# EAGLE schematic PowerConversionBoard (EAGLE 9.6.2)

## Sheet 1 of 2
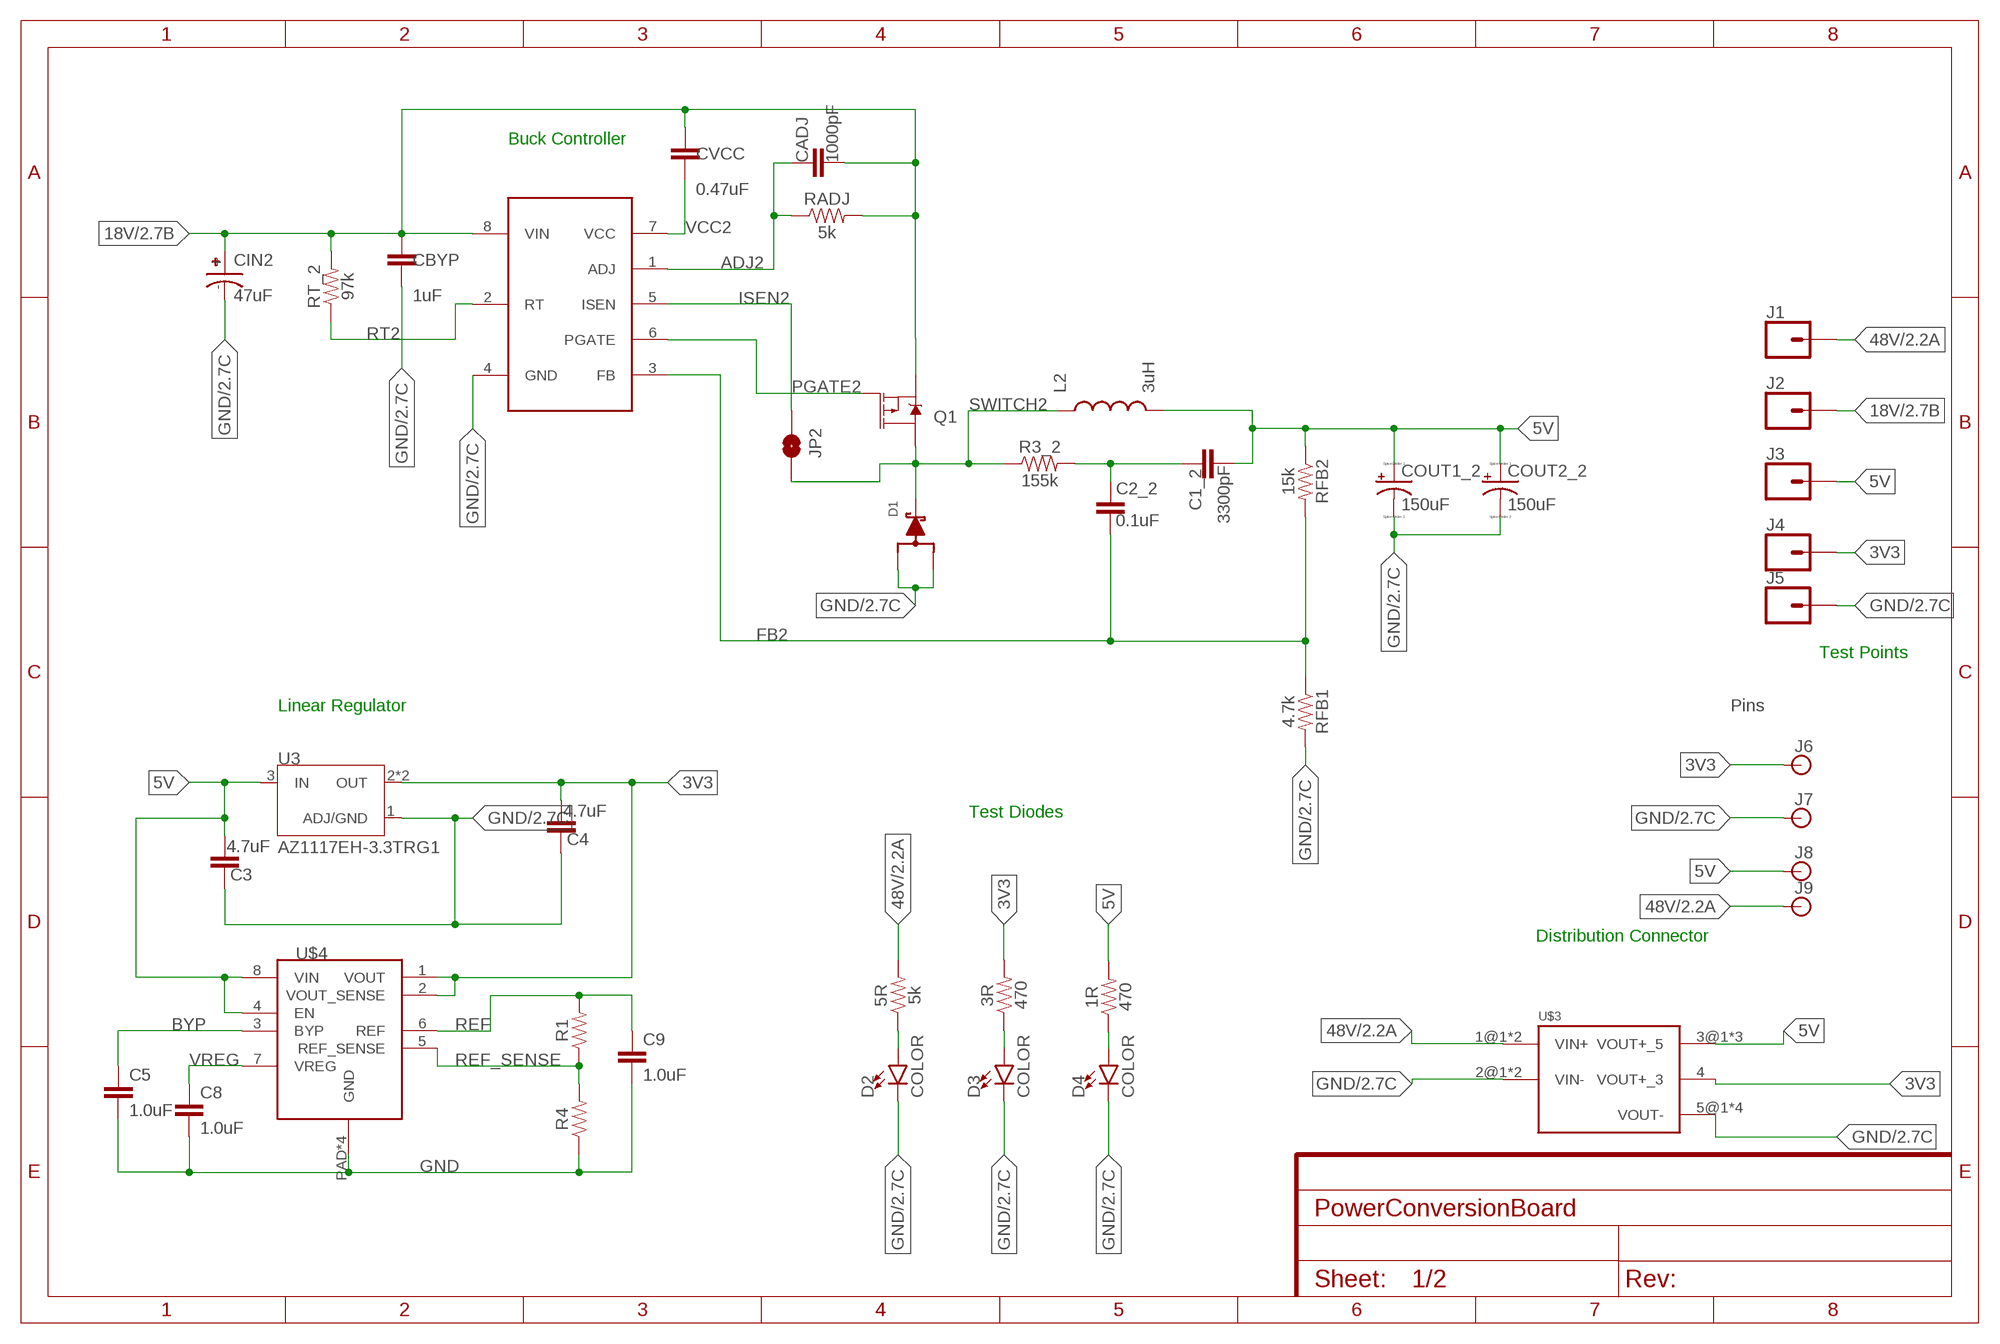
[diagram p0: schematic, sheet 1]

### Parts
1R  470  470OHM-0603-1/10W-1%  [0603]
3R  470  470OHM-0603-1/10W-1%  [0603]
5R  5k  470OHM-0603-1/10W-1%  [0603]
C1_2  3300pF  12PF-0603-50V-5%  [0603]
C2_2  0.1uF  12PF-0603-50V-5%  [0603]
C3  4.7uF  12PF-0603-50V-5%  [0603]
C4  4.7uF  12PF-0603-50V-5%  [0603]
C5  1.0uF  1.0UF-0603-16V-10%  [0603]
C8  1.0uF  1.0UF-0603-16V-10%  [0603]
C9  1.0uF  1.0UF-0603-16V-10%  [0603]
CADJ  1000pF  5.6PF-0603-50V-5%  [0603]
CBYP  1uF  3.3NF-0603-100V-10%  [0603]
CIN2  47uF  UCM1H331MNL1GS  [CAPAE1030X1050N]
COUT1_2  150uF  C-TANTALUM(10UF_150UF)  [CTAN(7.30_4.30MM)]
COUT2_2  150uF  C-TANTALUM(10UF_150UF)  [CTAN(7.30_4.30MM)]
CVCC  0.47uF  5.6PF-0603-50V-5%  [0603]
D1  SWITCHMODE_SCHOTTKY  [DPAK-3]
D2  COLOR  LED-0805  [0805]
D3  COLOR  LED-0805  [0805]
D4  COLOR  LED-0805  [0805]
J1  CONN_01  [1X01]
J2  CONN_01  [1X01]
J3  CONN_01  [1X01]
J4  CONN_01  [1X01]
J5  CONN_01  [1X01]
J6  BANANA_PTH  [BANANA_CONN_NO_THERM]
J7  BANANA_PTH  [BANANA_CONN_NO_THERM]
J8  BANANA_PTH  [BANANA_CONN_NO_THERM]
J9  BANANA_PTH  [BANANA_CONN_NO_THERM]
JP2  JUMPER-SMT_2_NO_SILK  [SMT-JUMPER_2_NO_SILK]
L2  3uH  HCMA1305  [HCMA1305]
Q1  MOSFET_PCH-NDS8434  [SO08]
R1  RESISTOR0603  [0603]
R3_2  155k  RESISTOR0603  [0603]
R4  RESISTOR0603  [0603]
RADJ  5k  RESISTOR0603  [0603]
RFB1  4.7k  RESISTOR0603  [0603]
RFB2  15k  RESISTOR0603  [0603]
RT_2  97k  82OHM-0603-1/10W-1%  [0603]
U3  AZ1117EH-3.3TRG1  [SOT230P700X180-4N]
U$1  LM5085  [LM5085]
U$3  CON2DIST  [CON2DIST]
U$4  ADP7159ARDZ-04-R7  [8-SOIC-EP]

### Nets
3V3: 3R.2 C4.1 J4.1 J6.1 U3.2(OUT) U3.4(OUT) U$3.4(VOUT+_3) U$4.1(VOUT) U$4.2(VOUT_SENSE)
5V: 1R.2 C1_2.1 C3.1 COUT1_2.+ COUT2_2.+ J3.1 J8.1 L2.2 RFB2.1 U3.3(IN) U$3.3@1(VOUT+_5) U$3.3@2(VOUT+_5) U$3.3@3(VOUT+_5) U$4.4(EN) U$4.8(VIN)
18V: CADJ.2 CBYP.1 CIN2.+ CVCC.1 J2.1 Q1.1(S) Q1.2(S) Q1.3(S) RADJ.2 RT_2.2 U$1.8(VIN) ; also sheet 2
48V: 5R.2 J1.1 J9.1 U$3.1@1(VIN+) U$3.1@2(VIN+) ; also sheet 2
ADJ2: CADJ.1 RADJ.1 U$1.1(ADJ)
BYP: C5.1 U$4.3(BYP)
FB2: C2_2.2 RFB1.1 RFB2.2 U$1.3(FB)
GND: C3.2 C4.2 C5.2 C8.2 C9.2 CBYP.2 CIN2.- COUT1_2.- COUT2_2.- D1.1(A) D1.3(A) D2.C D3.C D4.C J5.1 J7.1 R4.1 RFB1.2 U3.1(ADJ/GND) U$1.4(GND) U$3.2@1(VIN-) U$3.2@2(VIN-) U$3.5@1(VOUT-) U$3.5@2(VOUT-) U$3.5@3(VOUT-) U$3.5@4(VOUT-) U$4.PAD(GND) U$4.PAD_BOT(GND) U$4.PAD_VIA1(GND) U$4.PAD_VIA2(GND) ; also sheet 2
ISEN2: JP2.1 U$1.5(ISEN)
N$4: 5R.1 D2.A
N$5: 3R.1 D3.A
N$6: 1R.1 D4.A
N$11: C1_2.2 C2_2.1 R3_2.2
PGATE2: Q1.4(G) U$1.6(PGATE)
REF: C9.1 R1.2 U$4.6(REF)
REF_SENSE: R1.1 R4.2 U$4.5(REF_SENSE)
RT2: RT_2.1 U$1.2(RT)
SWITCH2: D1.4(C) JP2.2 L2.1 Q1.5(D) Q1.6(D) Q1.7(D) Q1.8(D) R3_2.1
VCC2: CVCC.2 U$1.7(VCC)
VREG: C8.1 U$4.7(VREG)

### Notes on the sheet
- Buck Controller
- Test Points
- Linear Regulator | Pins
- Test Diodes
- Distribution Connector

## Sheet 2 of 2
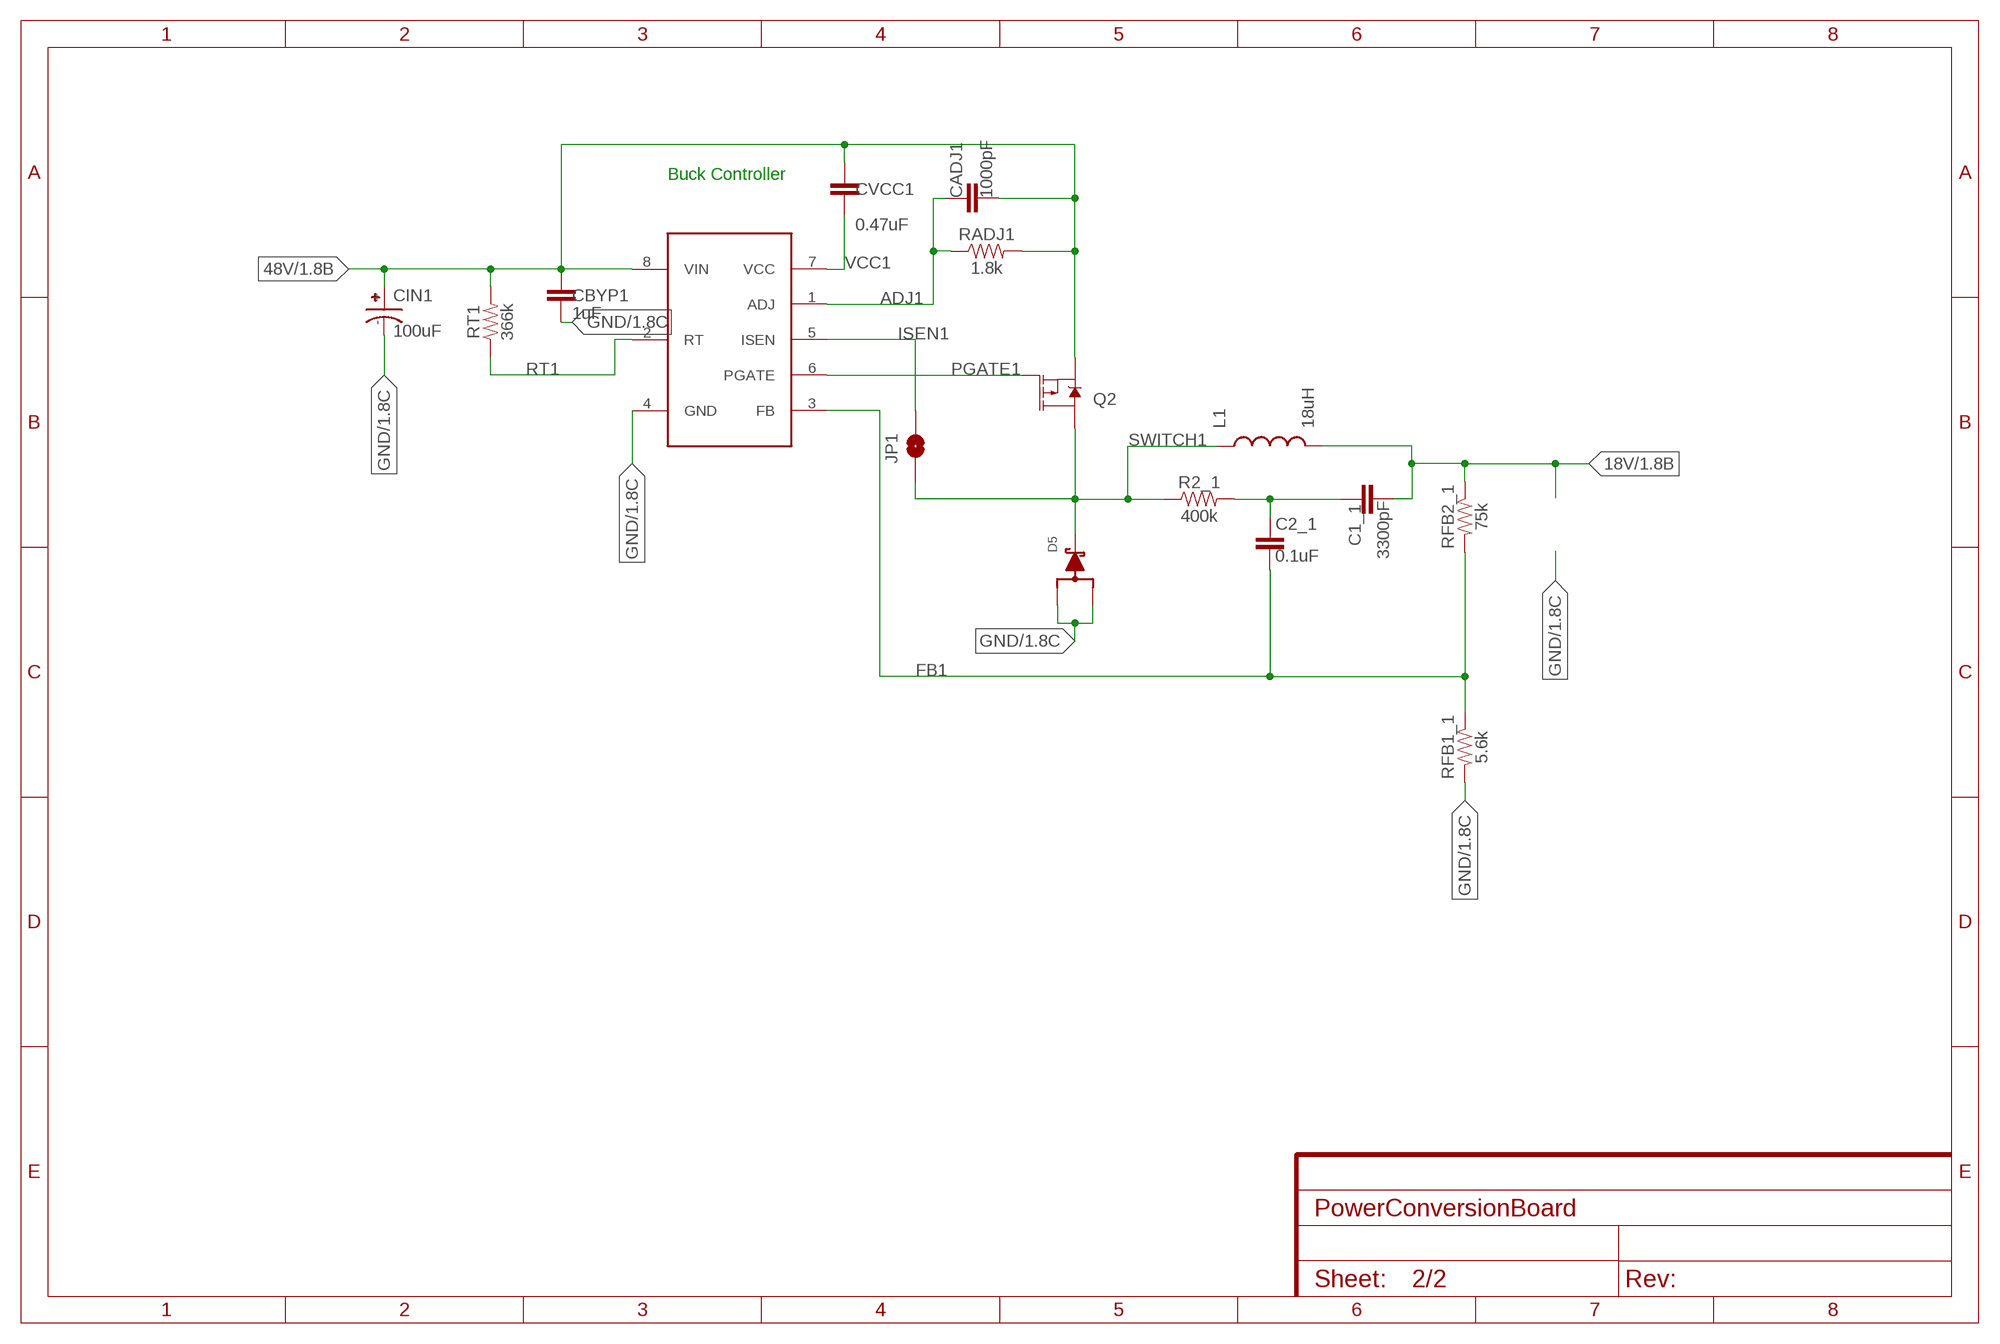
[diagram p1: schematic, sheet 2]

### Parts
C1_1  3300pF  12PF-0603-50V-5%  [0603]
C2_1  0.1uF  12PF-0603-50V-5%  [0603]
CADJ1  1000pF  5.6PF-0603-50V-5%  [0603]
CBYP1  1uF  3.3NF-0603-100V-10%  [0603]
CIN1  100uF  UCM1H331MNL1GS  [CAPAE1030X1050N]
CVCC1  0.47uF  5.6PF-0603-50V-5%  [0603]
D5  SWITCHMODE_SCHOTTKY  [DPAK-3]
JP1  JUMPER-SMT_2_NO_SILK  [SMT-JUMPER_2_NO_SILK]
L1  18uH  HCMA1305  [HCMA1305]
Q2  MOSFET_PCH-NDS8434  [SO08]
R2_1  400k  RESISTOR0603  [0603]
RADJ1  1.8k  RESISTOR0603  [0603]
RFB1_1  5.6k  RESISTOR0603  [0603]
RFB2_1  75k  RESISTOR0603  [0603]
RT1  366k  82OHM-0603-1/10W-1%  [0603]
U$2  LM5085  [LM5085]

### Nets
18V: C1_1.1 L1.2 RFB2_1.1 ; also sheet 1
48V: CADJ1.2 CBYP1.1 CIN1.+ CVCC1.1 Q2.1(S) Q2.2(S) Q2.3(S) RADJ1.2 RT1.2 U$2.8(VIN) ; also sheet 1
ADJ1: CADJ1.1 RADJ1.1 U$2.1(ADJ)
FB1: C2_1.2 RFB1_1.1 RFB2_1.2 U$2.3(FB)
GND: CBYP1.2 CIN1.- D5.1(A) D5.3(A) RFB1_1.2 U$2.4(GND) ; also sheet 1
ISEN1: JP1.2 U$2.5(ISEN)
N$1: C1_1.2 C2_1.1 R2_1.2
PGATE1: Q2.4(G) U$2.6(PGATE)
RT1: RT1.1 U$2.2(RT)
SWITCH1: D5.4(C) JP1.1 L1.1 Q2.5(D) Q2.6(D) Q2.7(D) Q2.8(D) R2_1.1
VCC1: CVCC1.2 U$2.7(VCC)

### Notes on the sheet
- Buck Controller

## Library data of the parts
1R 3R = SparkFun-Resistors:470OHM: 470Ω resistor A resistor is a passive two-terminal electrical component that implements electrical resistance as a circuit element. Resistors act to reduce current flow, and, at the same time, act to lower voltage levels within circuits. - Wikipedia; PROD_ID: RES-07869
5R = SparkFun-Resistors:470OHM: 470Ω resistor A resistor is a passive two-terminal electrical component that implements electrical resistance as a circuit element. Resistors act to reduce current flow, and, at the same time, act to lower voltage levels within circuits. - Wikipedia; PROD_ID: RES-07869; VALUE: 470
C1_1 C1_2 C2_1 C2_2 C3 C4 = SparkFun-Capacitors:12PF: 12pF ceramic capacitors A capacitor is a passive two-terminal electrical component used to store electrical energy temporarily in an electric field.; PROD_ID: CAP-09137; VALUE: 12pF
C5 C8 C9 = SparkFun-Capacitors:1.0UF: 1µF ceramic capacitors A capacitor is a passive two-terminal electrical component used to store electrical energy temporarily in an electric field.; PROD_ID: CAP-00868
CADJ CADJ1 CVCC CVCC1 = SparkFun-Capacitors:5.6PF: 5.6pF ceramic capacitors A capacitor is a passive two-terminal electrical component used to store electrical energy temporarily in an electric field.; PROD_ID: CAP-12456; VALUE: 5.6PF
CBYP CBYP1 = SparkFun-Capacitors:3.3NF: 3.3nF ceramic capacitors A capacitor is a passive two-terminal electrical component used to store electrical energy temporarily in an electric field.; PROD_ID: CAP-09633; VALUE: 3.3nF
CIN1 CIN2 = brick-capacitor-UCM1H331MNL1GS:UCM1H331MNL1GS: Nichicon 330uF 50 V Aluminium Electrolytic Capacitor SMD, CM Series 2000h 10 (Dia.) x 10mm Source: Datasheet <http://www.nichicon.co.jp/english/products/pdfs/e-ucm.pdf>; ARROW_PART_NUMBER: UCM1H331MNL1GS; ARROW_PRICE-STOCK: https://www.arrow.com/en/products/ucm1h331mnl1gs/nichicon; DESCRIPTION: Nichicon 330uF 50 V Aluminium Electrolytic Capacitor SMD, CM Series 2000h 10 (Dia.) x 10mm; HEIGHT: 10.5mm; MANUFACTURER_NAME: Nichicon; MANUFACTURER_PART_NUMBER: UCM1H331MNL1GS; MOUSER_PART_NUMBER: 647-UCM1H331MNL1GS; MOUSER_PRICE-STOCK: https://www.mouser.co.uk/ProductDetail/Nichicon/UCM1H331MNL1GS?qs=DSgADHjnLTkTovFLdbC%252BNg%3D%3D; VALUE: 330uF
COUT1_2 COUT2_2 = PowerComponents:C-TANTALUM(10UF_150UF)
D1 D5 = Schottky Diode 8A - MBRD835LT4G:SWITCHMODE_SCHOTTKY: {Digi-Key Part Number: MBRD835LT4GOSCT-ND} {Voltage - DC Reverse (Vr) (Max): 35V} {Current - Average Rectified (Io): 8A} {Voltage - Forward (Vf) (Max) @ If: 510mV @ 8A} {Speed: Fast Recovery =< 500ns, > 200mA (Io)} {Current - Reverse Leakage @ Vr: 1.4mA @ 35V} {Mounting Type: Surface Mount} {Package / Case: TO-252-3, DPak (2 Leads + Tab), SC-63} {Supplier Device Package: DPAK-3} {Operating Temperature - Junction: -65°C ~ 150°C}
D2-D4 = LED-0805:LED-0805
J1-J5 = SparkFun-Connectors:CONN_01: Single connection point. Often used as Generic Header-pin footprint for 0.1 inch spaced/style header connections On any of the 0.1 inch spaced packages, you can populate with these: Break Away Headers - Straight <https://www.sparkfun.com/products/116> (PRT-00116) Break Away Male Headers - Right Angle <https://www.sparkfun.com/products/553> (PRT-00553) Female Headers <https://www.sparkfun.com/products/115> (PRT-00115) Break Away Headers - Machine Pin <https://www.sparkfun.com/products/117> (PRT-00117) Break Away Female Headers - Swiss Machine Pin <https://www.sparkfun.com/products/743> (PRT-00743) This device is also useful as a general connection point to wire up your design to another part of your project. Our various solder wires solder well into these plated through hole pads. Hook-Up Wire - Assortment (Stranded, 22 AWG) <https://www.sparkfun.com/products/11375> (PRT-11375) Hook-Up Wire - Assortment (Solid Core, 22 AWG) <https://www.sparkfun.com/products/11367> (PRT-11367) View the entire wire category on our website here <https://www.sparkfun.com/categories/141> Special notes: SMTSO-256-ET is a "flush mount" nut for a 4-40 screw. We mostly use this on specialty testbeds; it is a nice way to connect hardware to your PCB at an adjustable hieght. Also note, the SNAP packages are for using a snappable style connector. We sell a baggie of snaps and they are also used on two LilyPad designs: Snap Assortment - 30 pack (male and female) <https://www.sparkfun.com/products/11347> (DEV-11347) LilyPad Arduino SimpleSnap <https://www.sparkfun.com/products/10941> (DEV-10941) LilyPad SimpleSnap Protoboard <https://www.sparkfun.com/products/10940> (DEV-10940)
J6-J9 = Banana Plug PTH:BANANA_PTH
JP1 JP2 = SparkFun-Jumpers:JUMPER-SMT_2_NO: Normally open jumper This jumper has two pads in close proximity to each other. Apply solder to close the connection. Round pads are easier to solder for beginners, but are a lot larger. SparkFun Product that uses the round pads: SparkFun EL Sequencer <https://www.sparkfun.com/products/12781>
L1 L2 = Inductor_15uH - hcma1305:HCMA1305: Eaton HCMA1305-150-R Inductor; VALUE: 15uH
Q1 Q2 = SparkFun-DiscreteSemi:MOSFET_PCH: P-channel MOSFETs Voltage controlled devices that allow control of high current outputs. SparkFun Products: SparkFun ESP32 Thing <https://www.sparkfun.com/products/13907> SparkFun ESP8266 Thing <https://www.sparkfun.com/products/13231>; PROD_ID: TRANS-08355; VALUE: 6.5A/20V/35mΩ
R1 R2_1 R3_2 R4 RADJ RADJ1 RFB1 RFB1_1 RFB2 RFB2_1 = SparkFun-Resistors:RESISTOR: Generic Resistor Package
RT1 RT_2 = SparkFun-Resistors:82OHM: 82Ω resistor A resistor is a passive two-terminal electrical component that implements electrical resistance as a circuit element. Resistors act to reduce current flow, and, at the same time, act to lower voltage levels within circuits. - Wikipedia; PROD_ID: RES-12311; VALUE: 82
U3 = Linear Regulator - AZ1117EH-3.3TRG1:AZ1117EH-3.3TRG1: Ldo.Vreg Pos 3, 3v 1a Sot223; AVAILABILITY: Unavailable; DESCRIPTION: Ldo.Vreg Pos 3, 3v 1a Sot223; MF: Diodes Inc.; MP: AZ1117EH-3.3TRG1; PACKAGE: SOT-223 Diodes Inc.; PRICE: None
U$1 U$2 = Buck_Controller:LM5085
U$3 = Dist_Convert_Connector:CON2DIST
U$4 = Linear Regulator - ADP7159:ADP7159ARDZ-04-R7